# EAGLE design mirobot_wifi_module (EAGLE 6.5.0)
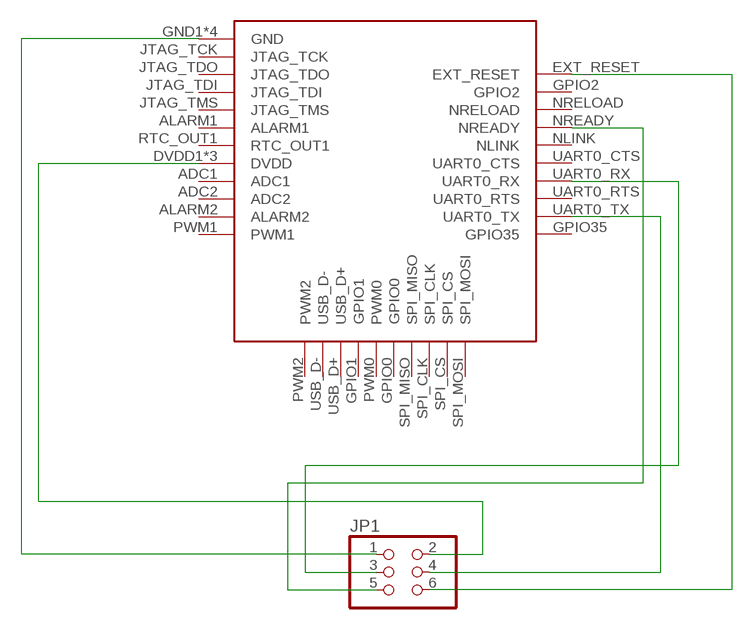
[diagram p0: schematic, sheet 1]

## Parts
JP1  PINHD-2X3  [2X03]
U$1  USR_WIFI  [WIFI_MODULE]

## Nets
GND: JP1.1 U$1.GND1(GND) U$1.GND2(GND) U$1.GND3(GND) U$1.GND4(GND)
N$2: JP1.2 U$1.DVDD1(DVDD) U$1.DVDD2(DVDD) U$1.DVDD3(DVDD)
N$3: JP1.3 U$1.UART0_RX
N$5: JP1.4 U$1.UART0_TX
N$6: JP1.5 U$1.NREADY
N$7: JP1.6 U$1.EXT_RESET
Unconnected: U$1.ADC1 U$1.ADC2 U$1.ALARM1 U$1.ALARM2 U$1.GPIO0 U$1.GPIO1 U$1.GPIO2 U$1.GPIO35 U$1.JTAG_TCK U$1.JTAG_TDI U$1.JTAG_TDO U$1.JTAG_TMS U$1.NLINK U$1.NRELOAD U$1.PWM0 U$1.PWM1 U$1.PWM2 U$1.RTC_OUT1 U$1.SPI_CLK U$1.SPI_CS U$1.SPI_MISO U$1.SPI_MOSI U$1.UART0_CTS U$1.UART0_RTS U$1.USB_D+ U$1.USB_D-

## Library data of the parts
JP1 = Child-Friendly-Parts:PINHD-2X3: PIN HEADER
U$1 = usr_wifi:USR_WIFI: USR WiFi Module

## Board
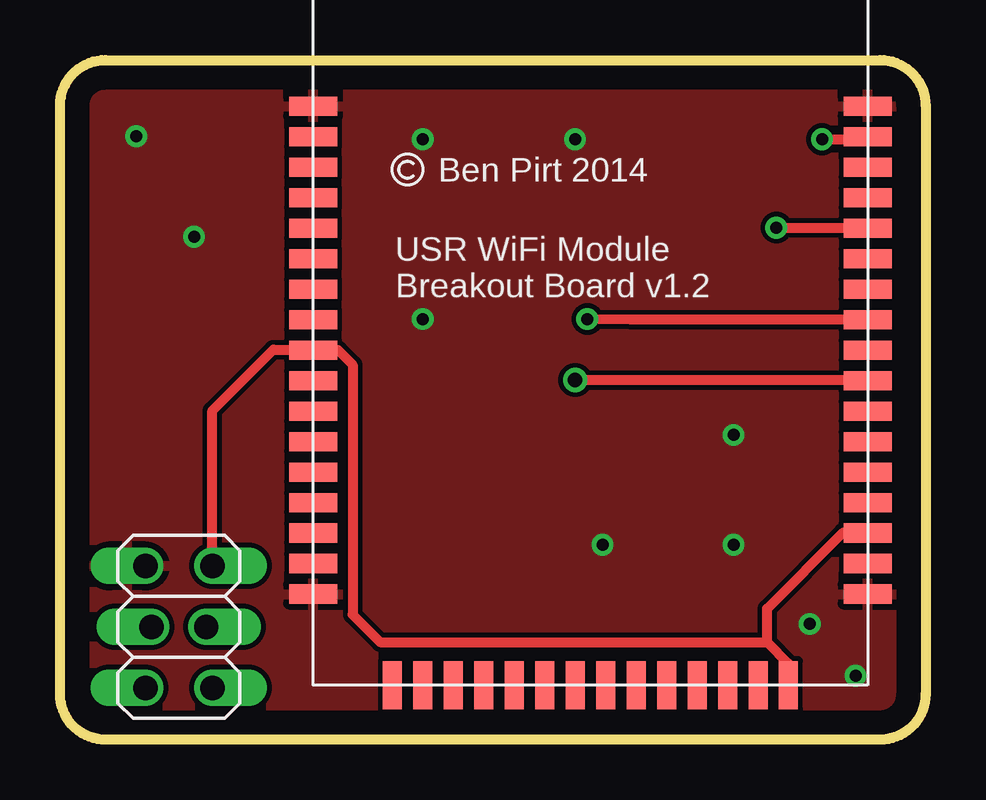
[diagram p1: board, top side]
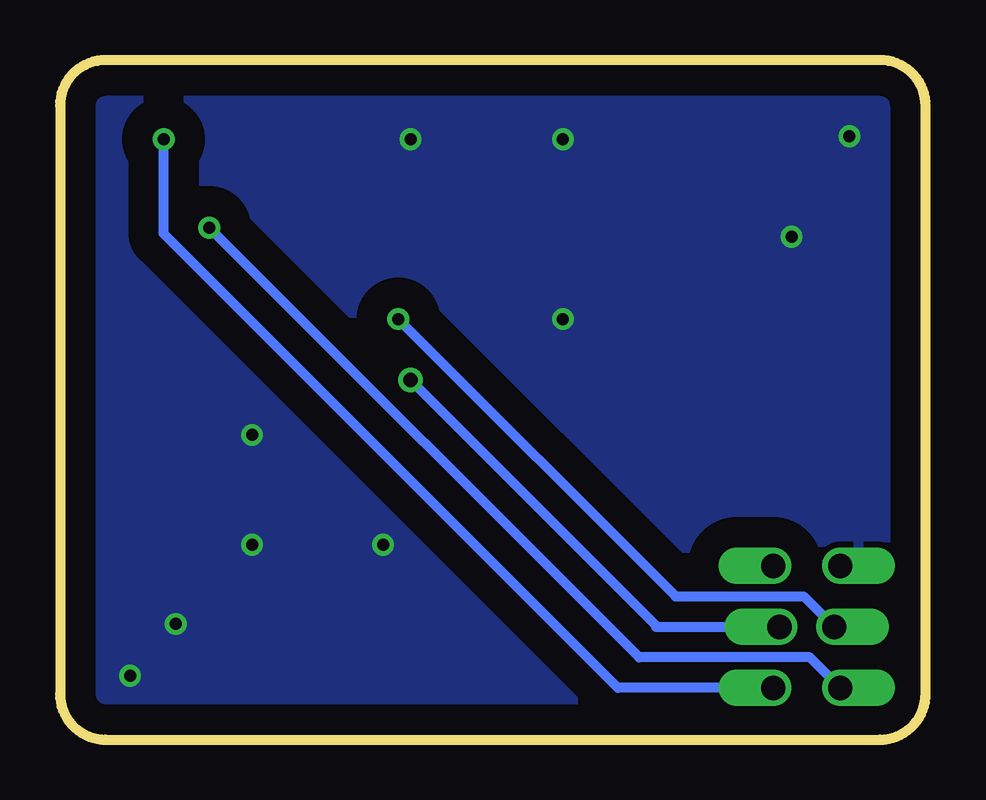
[diagram p2: board, bottom side, seen from below]

Size 36.07 x 28.32 mm. Coordinates in mm from the lower left corner, seen from the top.
Outline: 36.07,26.42 36.07,1.91 arc-90 34.16,0 1.91,0 arc-90 0,1.91 0,26.42 arc-90 1.91,28.32 34.16,28.32 arc-90 36.07,26.42
Copper layers (1*16): Top 0.035mm / dielectric 1.5mm / Bottom 0.035mm
Design rules "default *": minimum track width 10mil, minimum drill 0.5mm, track to track 8mil, track to pad 8mil, pad to pad 8mil, via to via 8mil, smd to smd 8mil, copper to edge 40mil, drill to drill 8mil, minimum pad ring 10mil, minimum via ring 8mil, stop-mask expansion 4mil, vias tented up to drill 20mil, thermal gap 10mil

### Footprints (pad centres in the part's own frame; a part is rotated, then mirrored left to right if it is on the bottom)
2X03 = drill 1.016 offset: 1 -2.54,-1.397; 2 -2.54,1.397; 3 0,-1.143; 4 0,1.143; 5 2.54,-1.397; 6 2.54,1.397
WIFI_MODULE = smd 2 x 0.8: ADC1 -11.55,-4.98; ADC2 -11.55,-6.25; ALARM1 -11.55,0.1; ALARM2 -11.55,-7.52; DVDD1 -11.55,-2.44; DVDD3 11.55,-10.06; EXT_RESET 11.55,6.45; GND1 -11.55,7.72; GND2 -11.55,-12.6; GND3 11.55,-12.6; GND4 11.55,7.72; GPIO2 11.55,5.18; GPIO35 11.55,-8.79; JTAG_TCK -11.55,6.45; JTAG_TDI -11.55,3.91; JTAG_TDO -11.55,5.18; JTAG_TMS -11.55,2.64; NC1 -11.55,1.37; NC2 -11.55,-3.71; NC3 -11.55,-8.79; NC4 -11.55,-10.06; NC8 11.55,-11.33; NC9 11.55,-7.52; NC10 11.55,-6.25; NC11 11.55,-4.98; NLINK 11.55,1.37; NREADY 11.55,2.64; NRELOAD 11.55,3.91; PWM1 -11.55,-11.33; RTC_OUT1 -11.55,-1.17; UART0_CTS 11.55,0.1; UART0_RTS 11.55,-2.44; UART0_RX 11.55,-1.17; UART0_TX 11.55,-3.71 | smd 0.8 x 2: DVDD2 8.25,-16.4; GPIO0 1.91,-16.4; GPIO1 -1.9,-16.4; NC5 -8.25,-16.4; NC6 -6.98,-16.4; NC7 0.64,-16.4; PWM0 -0.63,-16.4; PWM2 -5.71,-16.4; SPI_CLK 4.45,-16.4; SPI_CS 5.72,-16.4; SPI_MISO 3.18,-16.4; SPI_MOSI 6.99,-16.4; USB_D+ -3.17,-16.4; USB_D- -4.44,-16.4

### Placement (x,y rotation side)
JP1  4.95,4.7 270 top
U$1  22.1,18.67 0 top

### Tracks (layer width: path | path; a pad name or v marks a point on that pad's centre or on a via)
GND  (via drill 0.5)
  other vias: 31.24,4.83 33.15,2.67 3.17,25.15 5.59,20.96 15.11,25.02 21.46,25.02 15.11,17.53 28.07,12.7 28.07,8.13 22.61,8.13
  pour Top: -0.13,27.05 39.24,27.05 39.24,-0.64 -0.13,-0.64
  pour Bottom (isolate 1.27): -0.13,27.05 39.24,27.05 39.24,-0.64 -0.13,-0.64
N$2
  Top 0.406: 29.46,4.06 13.33,4.06 12.19,5.21 12.19,15.62 11.58,16.23 U$1.DVDD1 10.52,16.26 8.89,16.26 6.35,13.72 JP1.2 | 29.46,4.06 30.35,3.17 U$1.DVDD2 | 29.46,4.06 29.46,5.46 32.64,8.64 34.26,8.64 U$1.DVDD3
N$3  (via drill 0.5)
  Top 0.406: U$1.UART0_RX 23.78,17.5 v21.97,17.53
  Bottom 0.406: v21.97,17.53 10.41,5.97 5.08,5.97 JP1.3
N$5  (via drill 0.6)
  Top 0.406: U$1.UART0_TX 33.62,14.99 v21.46,14.99
  Bottom 0.406: 11.23,4.7 11.18,4.7 | JP1.4 11.05,4.7 11.18,4.7 | v21.46,14.99 11.18,4.7
N$6  (via drill 0.5)
  Top 0.406: v29.85,21.34 34.26,21.34 U$1.NREADY
  Bottom 0.406: JP1.5 4.83,3.43 11.94,3.43 v29.85,21.34
N$7  (via drill 0.5)
  Top 0.406: v31.75,25.02 34.18,25.02 U$1.EXT_RESET
  Bottom 0.406: JP1.6 12.83,2.16 31.75,21.08 v31.75,25.02

### Text on the board
tNames: Ben Pirt 2014 | USR WiFi Module / Breakout Board v1.2